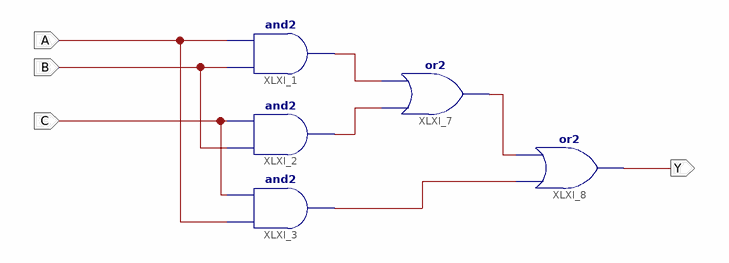
[diagram p0: schematic sheet 1]
// Xilinx ISE schematic MAJORITY.sch (spartan6) as structural Verilog: 5 symbols, 4 ports
module MAJORITY (
  input  A,
  input  B,
  input  C,
  output Y
);

  wire XLXN_4, XLXN_5, XLXN_6, XLXN_7;

  and XLXI_1 (XLXN_4, B, A);
  and XLXI_2 (XLXN_5, B, C);
  and XLXI_3 (XLXN_7, A, C);
  or XLXI_7 (XLXN_6, XLXN_5, XLXN_4);
  or XLXI_8 (Y, XLXN_7, XLXN_6);
endmodule
